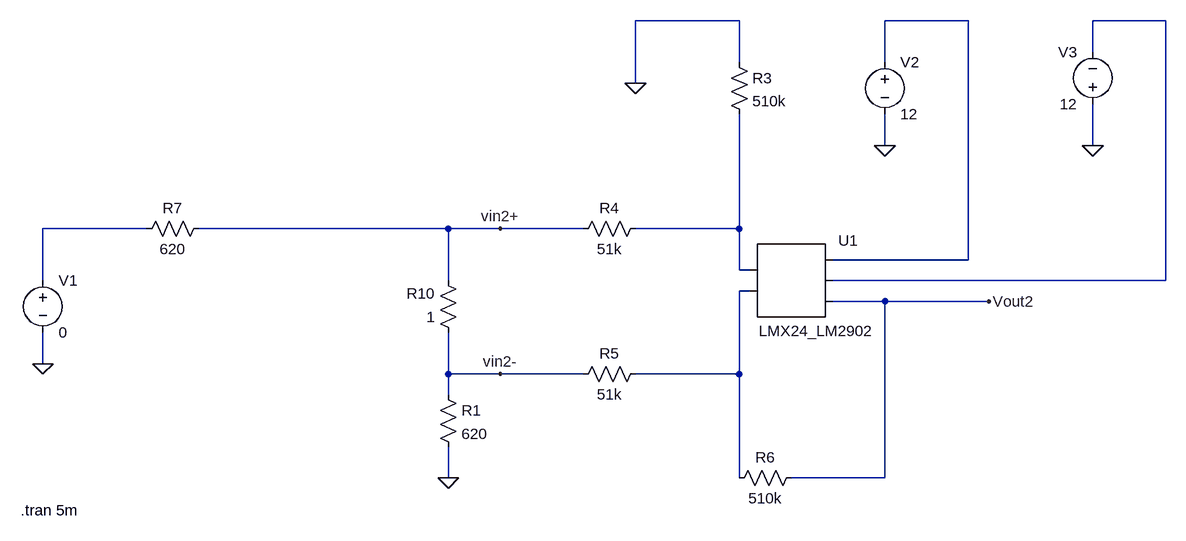
[diagram p0: schematic SimulacaoRelatorio1Part4.asc]
SimulacaoRelatorio1Part4.asc, the LTspice schematic file:
Version 4
SHEET 1 1124 680
WIRE 464 -144 304 -144
WIRE 816 -144 688 -144
WIRE 1120 -144 1008 -144
WIRE 1008 -96 1008 -144
WIRE 464 -80 464 -144
WIRE 688 -80 688 -144
WIRE 304 -48 304 -144
WIRE 688 48 688 0
WIRE 1008 48 1008 -16
WIRE -448 176 -608 176
WIRE 16 176 -368 176
WIRE 96 176 16 176
WIRE 224 176 96 176
WIRE 464 176 464 0
WIRE 464 176 304 176
WIRE 816 224 816 -144
WIRE 816 224 608 224
WIRE 464 240 464 176
WIRE 480 240 464 240
WIRE -608 256 -608 176
WIRE 16 256 16 176
WIRE 1120 256 1120 -144
WIRE 1120 256 608 256
WIRE 480 272 464 272
WIRE 688 288 608 288
WIRE 848 288 688 288
WIRE -608 384 -608 336
WIRE 16 400 16 336
WIRE 96 400 16 400
WIRE 224 400 96 400
WIRE 464 400 464 272
WIRE 464 400 304 400
WIRE 16 432 16 400
WIRE 16 560 16 512
WIRE 464 560 464 400
WIRE 688 560 688 288
WIRE 688 560 544 560
FLAG -608 384 0
FLAG 304 -48 0
FLAG 688 48 0
FLAG 1008 48 0
FLAG 848 288 Vout2
FLAG 96 176 vin2+
FLAG 96 400 vin2-
FLAG 16 560 0
SYMBOL voltage -608 240 R0
SYMATTR InstName V1
SYMATTR Value 0
SYMBOL res 32 352 R180
WINDOW 0 36 76 Left 2
WINDOW 3 36 40 Left 2
SYMATTR InstName R10
SYMATTR Value 1
SYMBOL res 208 416 R270
WINDOW 0 32 56 VTop 2
WINDOW 3 0 56 VBottom 2
SYMATTR InstName R5
SYMATTR Value 51k
SYMBOL res 560 544 R90
WINDOW 0 0 56 VBottom 2
WINDOW 3 32 56 VTop 2
SYMATTR InstName R6
SYMATTR Value 510k
SYMBOL res 320 160 R90
WINDOW 0 0 56 VBottom 2
WINDOW 3 32 56 VTop 2
SYMATTR InstName R4
SYMATTR Value 51k
SYMBOL AutoGenerated\\LMX24_LM2902 544 256 R0
WINDOW 3 39 62 Top 2
SYMATTR InstName U1
SYMBOL res 448 -96 R0
SYMATTR InstName R3
SYMATTR Value 510k
SYMBOL voltage 688 -96 R0
SYMATTR InstName V2
SYMATTR Value 12
SYMBOL voltage 1008 0 R180
WINDOW 0 24 96 Left 2
WINDOW 3 24 16 Left 2
WINDOW 123 0 0 Left 0
WINDOW 39 0 0 Left 0
SYMATTR InstName V3
SYMATTR Value 12
SYMBOL res 0 416 R0
SYMATTR InstName R1
SYMATTR Value 620
SYMBOL res -352 160 R90
WINDOW 0 0 56 VBottom 2
WINDOW 3 32 56 VTop 2
SYMATTR InstName R7
SYMATTR Value 620
TEXT -642 610 Left 2 !.tran 5m

The netlist it stands for:
* SimulacaoRelatorio1Part4.asc
V1 N003 0 0
R10 vin2- vin2+ 1
R5 vin2- N005 51k
R6 Vout2 N005 510k
R4 N004 vin2+ 51k
* U1: LMX24_LM2902 (symbol AutoGenerated\LMX24_LM2902 not available, pins judged from their places): pin1=N004 pin2=N005 pin3=N001 pin4=N002 pin5=Vout2
R3 0 N004 510k
V2 N001 0 12
V3 0 N002 12
R1 vin2- 0 620
R7 vin2+ N003 620
.tran 5m
.backanno
.end